# EAGLE schematic growth_pcb (EAGLE 9.6.2)
REV: p2; TITLE: Elemental Growth
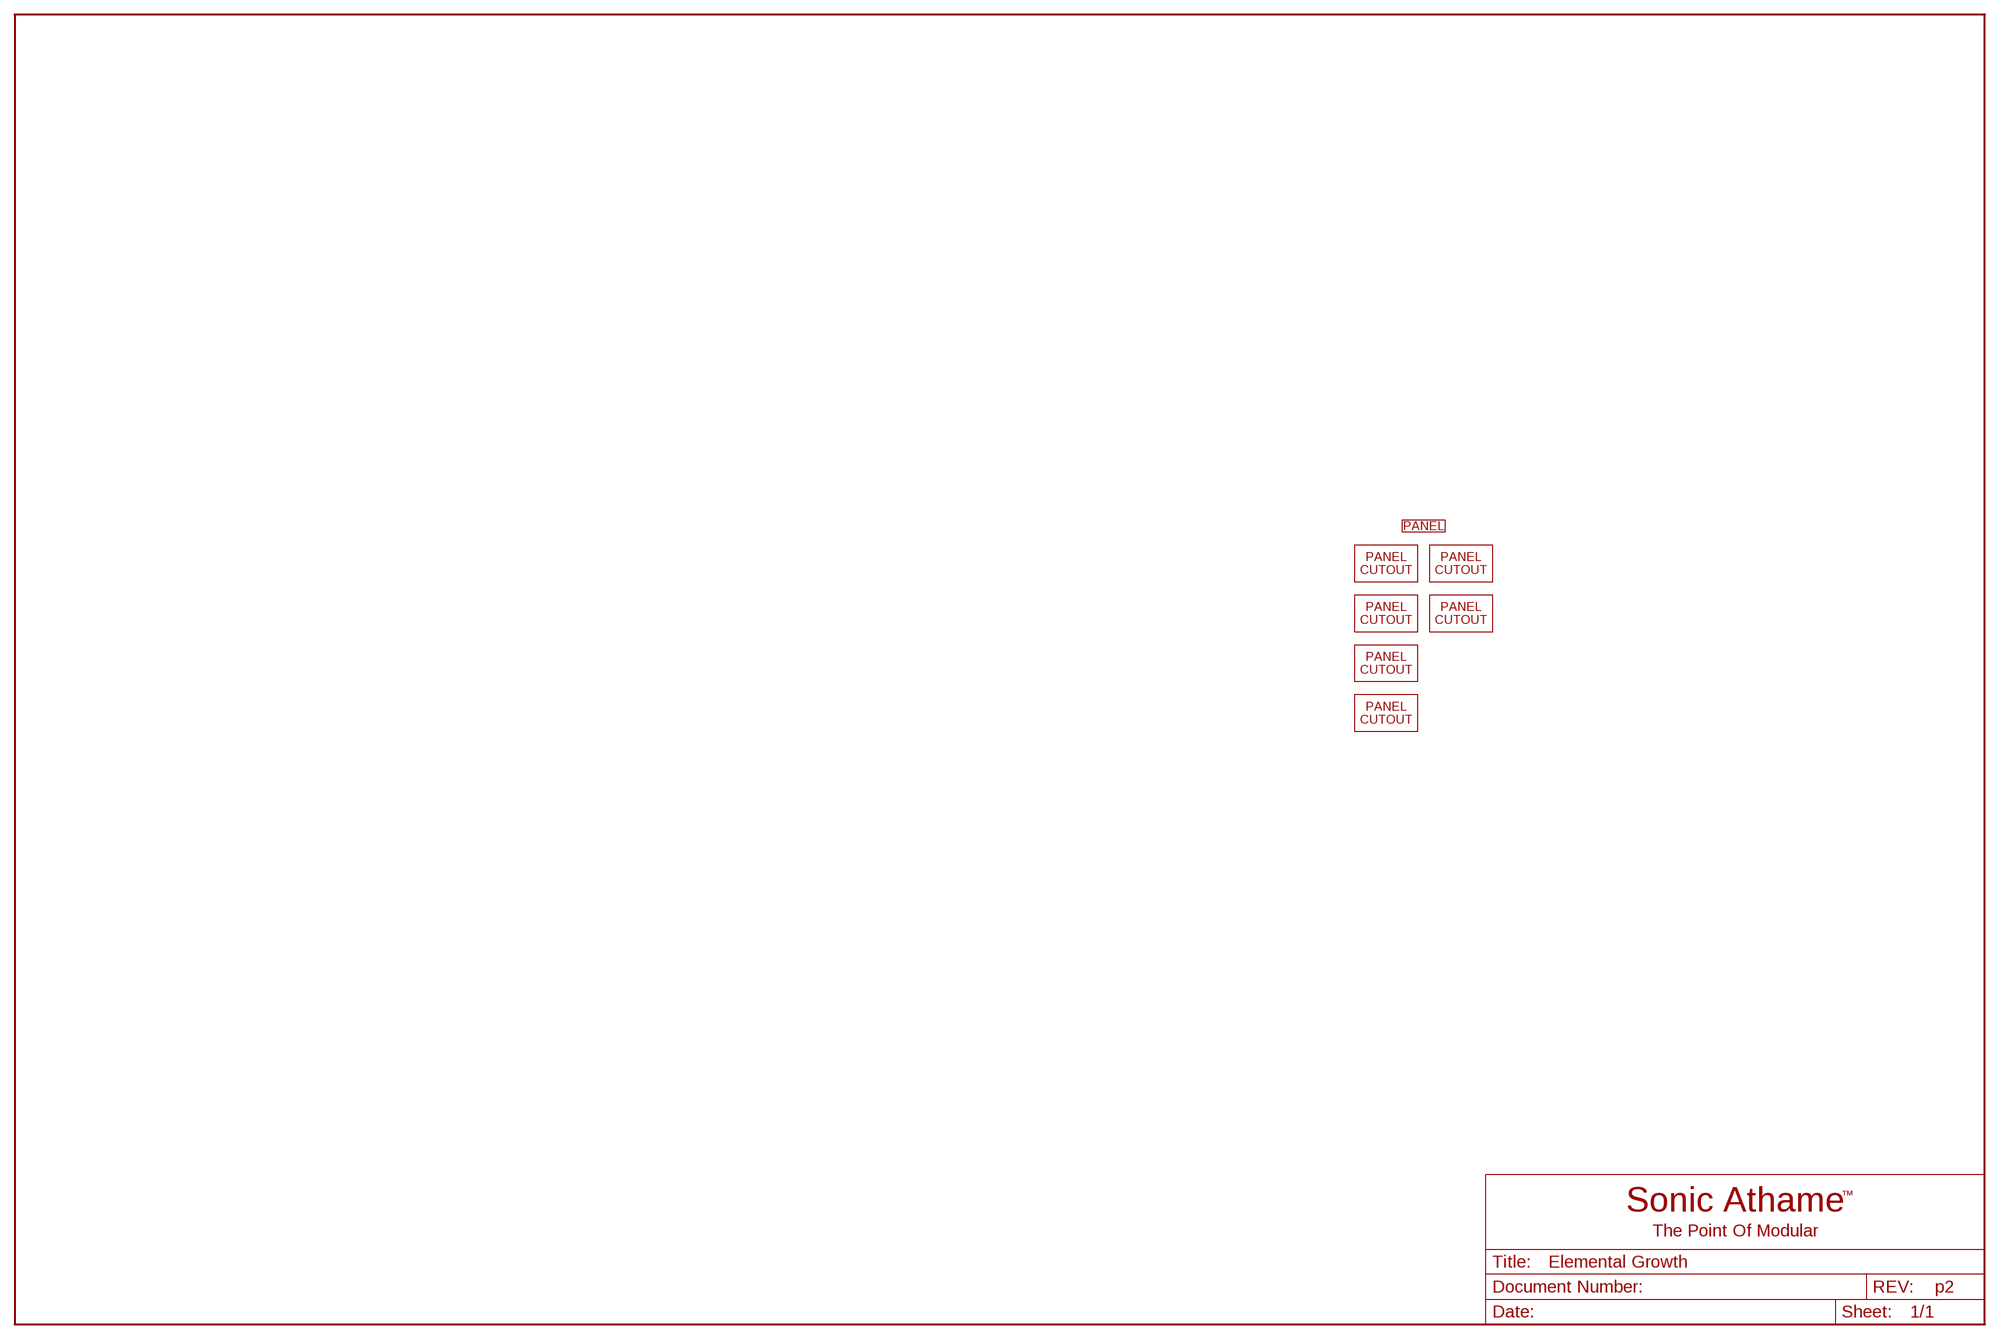
[diagram p0: schematic, sheet 1]

## Parts
CUTOUT1  PANEL_CUTOUTSALPHA_POT_VERTICAL  [ALPHA_POT_VERTICAL_PANEL]
CUTOUT2  PANEL_CUTOUTSALPHA_POT_VERTICAL  [ALPHA_POT_VERTICAL_PANEL]
CUTOUT3  PANEL_CUTOUTSWQP-PJ398SM  [WQP-PJ398SM_PANEL]
CUTOUT4  PANEL_CUTOUTSWQP-PJ398SM  [WQP-PJ398SM_PANEL]
CUTOUT5  PANEL_CUTOUTSWQP-PJ398SM  [WQP-PJ398SM_PANEL]
CUTOUT6  PANEL_CUTOUTSWQP-PJ398SM  [WQP-PJ398SM_PANEL]
U$2  PANEL4U  [PANEL_4U]

## Library data of the parts
CUTOUT1-CUTOUT6 = SonicAthame:PANEL_CUTOUTS
U$2 = SonicAthame:PANEL